# Altium project bor2pin.PrjPCB
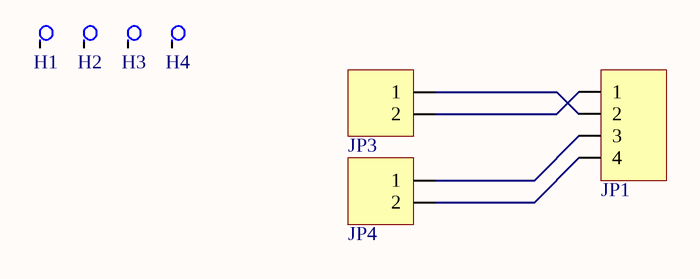
[diagram p0: bor2pin.SchDoc]
1 sheet, 7 parts. Net scope: global (net labels, ports and power ports of the same name join across sheets).
Board file: bor2pin.PcbDoc

## Sheet bor2pin.SchDoc
size A; PageSetup: Record=PageOptions|CenterHorizontal=True|CenterVertical=True|PrintScale=1.00|XCorrection=1.00|YCorrection=1.00|PrintKind=1|BorderSize=5000000|LeftOffset=0|BottomOffset=0|Orientation=2|PaperLength=1000|PaperWidth=1000|Scale=100|PaperSource=7|PrintQuality=-4|MediaType=1|DitherType=10|PaperKind=A4 (8.2 x 11.7 in; 210 x 297 mm)|PrintScaleMode=1

### Parts
H1  Agujero de Montaje  [agujero]  (value not drawn)  (no BOM)
H2  Agujero de Montaje  [agujero]  (value not drawn)  (no BOM)
H3  Agujero de Montaje  [agujero]  (value not drawn)  (no BOM)
H4  Agujero de Montaje  [agujero]  (value not drawn)  (no BOM)
JP1  Header4x1  [CONPOL4x1_90]  (value not drawn)
JP3  Header2x1  [BORNERA2_ENCH]  (value not drawn)
JP4  Header2x1  [BORNERA2_ENCH]  (value not drawn)

### Nets
NetJP1_1: JP1.1 JP3.2
NetJP1_2: JP1.2 JP3.1
NetJP1_3: JP1.3 JP4.1
NetJP1_4: JP1.4 JP4.2

Not connected (* = marked no-connect by the designer): H1 1; H2 1; H3 1; H4 1

### Library data of the parts
JP1 = Header4x1: Header 4x1; Price: ?
JP3 JP4 = Header2x1: Header 2x1; Price: ?